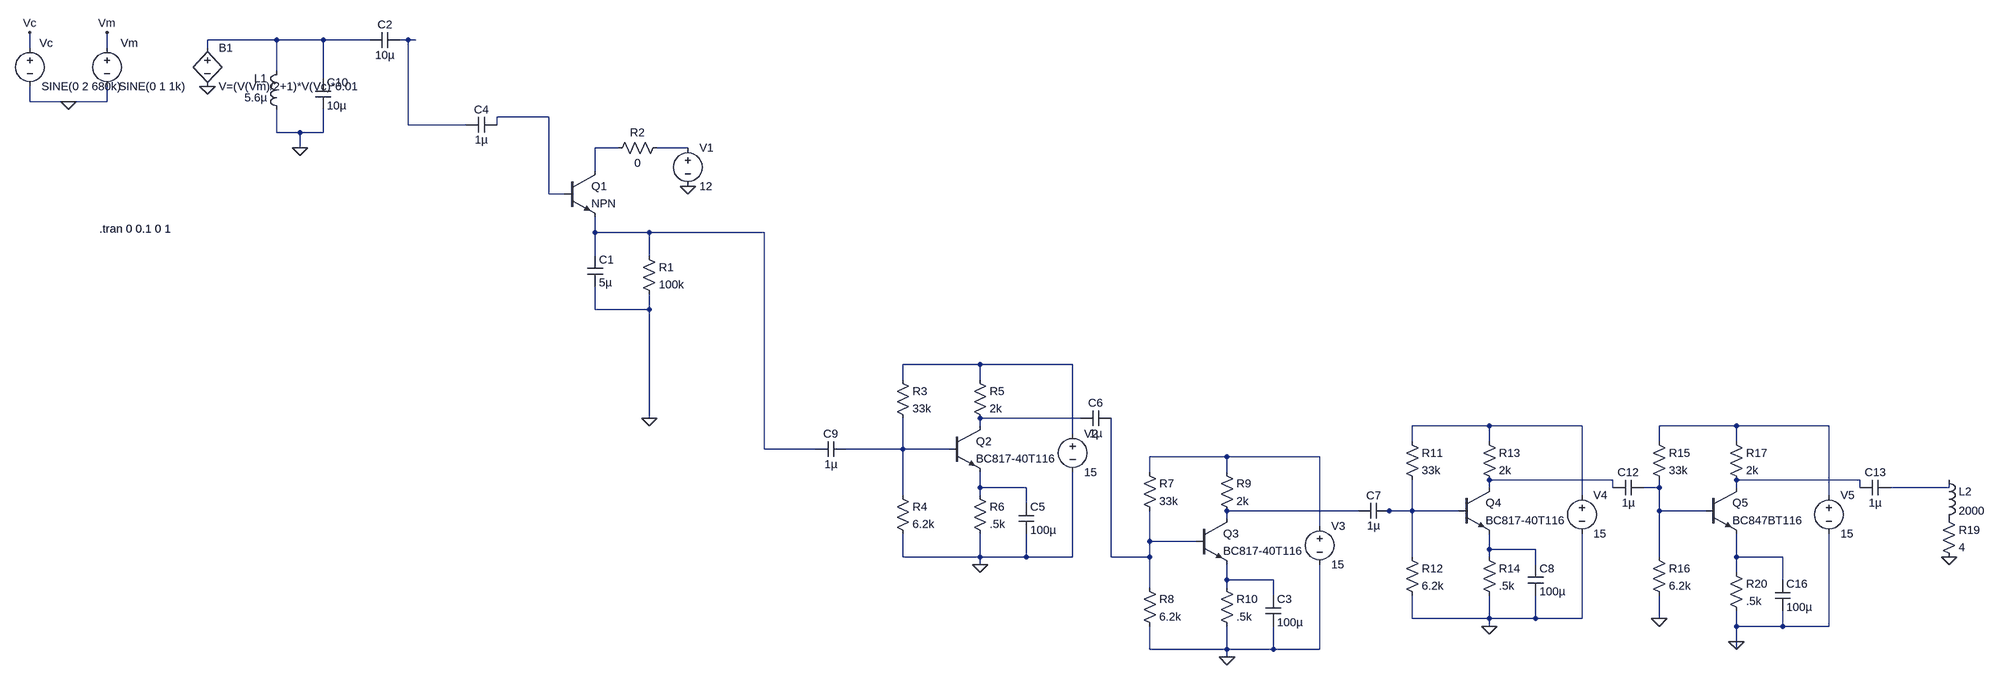
[diagram p0: schematic Final Draft3.asc]
Final Draft3.asc, the LTspice schematic file:
Version 4
SHEET 1 4400 1892
WIRE -352 160 -496 160
WIRE -256 160 -352 160
WIRE -160 160 -256 160
WIRE -80 160 -96 160
WIRE -64 160 -80 160
WIRE -864 176 -864 144
WIRE -704 176 -704 144
WIRE -496 176 -496 160
WIRE -352 224 -352 160
WIRE -256 240 -256 160
WIRE -864 288 -864 256
WIRE -784 288 -864 288
WIRE -704 288 -704 256
WIRE -704 288 -784 288
WIRE 512 320 336 320
WIRE -80 336 -80 160
WIRE 272 336 -80 336
WIRE 336 336 336 320
WIRE -352 352 -352 304
WIRE -304 352 -352 352
WIRE -256 352 -256 304
WIRE -256 352 -304 352
WIRE -304 384 -304 352
WIRE 656 384 608 384
WIRE 800 384 736 384
WIRE 608 432 608 384
WIRE 512 480 512 320
WIRE 544 480 512 480
WIRE 608 560 608 528
WIRE 720 560 608 560
WIRE 1072 560 720 560
WIRE 608 608 608 560
WIRE 720 608 720 560
WIRE 608 720 608 672
WIRE 720 720 720 688
WIRE 720 720 608 720
WIRE 1616 912 1456 912
WIRE 1808 912 1616 912
WIRE 1456 944 1456 912
WIRE 1616 944 1616 912
WIRE 720 1024 720 720
WIRE 1824 1024 1616 1024
WIRE 1616 1040 1616 1024
WIRE 2672 1040 2512 1040
WIRE 2864 1040 2672 1040
WIRE 3184 1040 3024 1040
WIRE 3376 1040 3184 1040
WIRE 1808 1056 1808 912
WIRE 2512 1072 2512 1040
WIRE 2672 1072 2672 1040
WIRE 3024 1072 3024 1040
WIRE 3184 1072 3184 1040
WIRE 1072 1088 1072 560
WIRE 1248 1088 1072 1088
WIRE 1456 1088 1456 1024
WIRE 1456 1088 1312 1088
WIRE 1552 1088 1456 1088
WIRE 2128 1104 1968 1104
WIRE 2320 1104 2128 1104
WIRE 1968 1136 1968 1104
WIRE 2128 1136 2128 1104
WIRE 2928 1152 2672 1152
WIRE 3440 1152 3184 1152
WIRE 1616 1168 1616 1136
WIRE 1712 1168 1616 1168
WIRE 2672 1168 2672 1152
WIRE 2928 1168 2928 1152
WIRE 3024 1168 3024 1152
WIRE 3024 1168 2992 1168
WIRE 3184 1168 3184 1152
WIRE 3440 1168 3440 1152
WIRE 3840 1168 3840 1152
WIRE 3840 1168 3504 1168
WIRE 1456 1184 1456 1088
WIRE 1616 1184 1616 1168
WIRE 2864 1184 2864 1040
WIRE 3376 1184 3376 1040
WIRE 1712 1200 1712 1168
WIRE 2400 1216 2128 1216
WIRE 2464 1216 2448 1216
WIRE 2512 1216 2512 1152
WIRE 2512 1216 2464 1216
WIRE 2608 1216 2512 1216
WIRE 3024 1216 3024 1168
WIRE 3120 1216 3024 1216
WIRE 2128 1232 2128 1216
WIRE 2320 1248 2320 1104
WIRE 1968 1280 1968 1216
WIRE 2064 1280 1968 1280
WIRE 2672 1296 2672 1264
WIRE 2768 1296 2672 1296
WIRE 1456 1312 1456 1264
WIRE 1616 1312 1616 1264
WIRE 1616 1312 1456 1312
WIRE 1712 1312 1712 1264
WIRE 1712 1312 1616 1312
WIRE 1808 1312 1808 1136
WIRE 1808 1312 1712 1312
WIRE 1888 1312 1888 1024
WIRE 1968 1312 1968 1280
WIRE 1968 1312 1888 1312
WIRE 2512 1312 2512 1216
WIRE 2672 1312 2672 1296
WIRE 3024 1312 3024 1216
WIRE 3184 1312 3184 1264
WIRE 3280 1312 3184 1312
WIRE 1616 1328 1616 1312
WIRE 2768 1328 2768 1296
WIRE 3184 1344 3184 1312
WIRE 2128 1360 2128 1328
WIRE 2224 1360 2128 1360
WIRE 3280 1360 3280 1312
WIRE 1968 1376 1968 1312
WIRE 2128 1376 2128 1360
WIRE 2224 1392 2224 1360
WIRE 2512 1440 2512 1392
WIRE 2672 1440 2672 1392
WIRE 2672 1440 2512 1440
WIRE 2768 1440 2768 1392
WIRE 2768 1440 2672 1440
WIRE 2864 1440 2864 1264
WIRE 2864 1440 2768 1440
WIRE 3024 1440 3024 1392
WIRE 2672 1456 2672 1440
WIRE 3184 1456 3184 1424
WIRE 3280 1456 3280 1424
WIRE 3280 1456 3184 1456
WIRE 3376 1456 3376 1264
WIRE 3376 1456 3280 1456
WIRE 3184 1488 3184 1456
WIRE 1968 1504 1968 1456
WIRE 2128 1504 2128 1456
WIRE 2128 1504 1968 1504
WIRE 2224 1504 2224 1456
WIRE 2224 1504 2128 1504
WIRE 2320 1504 2320 1328
WIRE 2320 1504 2224 1504
WIRE 3184 1504 3184 1488
WIRE 2128 1520 2128 1504
FLAG -496 256 0
FLAG -784 288 0
FLAG -704 144 Vm
FLAG -864 144 Vc
FLAG 800 464 0
FLAG 2128 1520 0
FLAG 2672 1456 0
FLAG -304 384 0
FLAG 1616 1328 0
FLAG 720 1024 0
FLAG 3184 1488 0
FLAG 3024 1440 0
FLAG 3840 1312 0
SYMBOL cap 592 608 R0
SYMATTR InstName C1
SYMATTR Value 5µ
SYMBOL res 704 592 R0
SYMATTR InstName R1
SYMATTR Value 100k
SYMBOL bv -496 160 R0
SYMATTR InstName B1
SYMATTR Value V=(V(Vm)/2+1)*V(Vc)*0.01
SYMBOL voltage -864 160 R0
WINDOW 123 0 0 Left 2
WINDOW 39 0 0 Left 2
WINDOW 0 20 6 Left 2
SYMATTR InstName Vc
SYMATTR Value SINE(0 2 680k)
SYMBOL voltage -704 160 R0
WINDOW 123 0 0 Left 2
WINDOW 39 0 0 Left 2
WINDOW 0 28 6 Left 2
SYMATTR InstName Vm
SYMATTR Value SINE(0 1 1k)
SYMBOL voltage 800 368 R0
WINDOW 123 0 0 Left 2
WINDOW 39 0 0 Left 2
SYMATTR InstName V1
SYMATTR Value 12
SYMBOL res 752 368 R90
WINDOW 0 0 56 VBottom 2
WINDOW 3 32 56 VTop 2
SYMATTR InstName R2
SYMATTR Value 0
SYMBOL cap -96 144 R90
WINDOW 0 0 32 VBottom 2
WINDOW 3 32 32 VTop 2
SYMATTR InstName C2
SYMATTR Value 10µ
SYMBOL res 1440 928 R0
SYMATTR InstName R3
SYMATTR Value 33k
SYMBOL res 1440 1168 R0
SYMATTR InstName R4
SYMATTR Value 6.2k
SYMBOL voltage 1808 1040 R0
WINDOW 123 0 0 Left 2
WINDOW 39 0 0 Left 2
SYMATTR InstName V2
SYMATTR Value 15
SYMBOL res 1600 928 R0
SYMATTR InstName R5
SYMATTR Value 2k
SYMBOL res 1600 1168 R0
SYMATTR InstName R6
SYMATTR Value .5k
SYMBOL cap 1696 1200 R0
SYMATTR InstName C5
SYMATTR Value 100µ
SYMBOL cap 336 320 R90
WINDOW 0 0 32 VBottom 2
WINDOW 3 32 32 VTop 2
SYMATTR InstName C4
SYMATTR Value 1µ
SYMBOL npn 2064 1232 R0
SYMATTR InstName Q3
SYMATTR Value BC817-40T116
SYMBOL res 1952 1120 R0
SYMATTR InstName R7
SYMATTR Value 33k
SYMBOL res 1952 1360 R0
SYMATTR InstName R8
SYMATTR Value 6.2k
SYMBOL voltage 2320 1232 R0
WINDOW 123 0 0 Left 2
WINDOW 39 0 0 Left 2
SYMATTR InstName V3
SYMATTR Value 15
SYMBOL res 2112 1120 R0
SYMATTR InstName R9
SYMATTR Value 2k
SYMBOL res 2112 1360 R0
SYMATTR InstName R10
SYMATTR Value .5k
SYMBOL cap 2208 1392 R0
SYMATTR InstName C3
SYMATTR Value 100µ
SYMBOL cap 2464 1200 R90
WINDOW 0 0 32 VBottom 2
WINDOW 3 32 32 VTop 2
SYMATTR InstName C7
SYMATTR Value 1µ
SYMBOL npn 2608 1168 R0
SYMATTR InstName Q4
SYMATTR Value BC817-40T116
SYMBOL res 2496 1056 R0
SYMATTR InstName R11
SYMATTR Value 33k
SYMBOL res 2496 1296 R0
SYMATTR InstName R12
SYMATTR Value 6.2k
SYMBOL voltage 2864 1168 R0
WINDOW 123 0 0 Left 2
WINDOW 39 0 0 Left 2
SYMATTR InstName V4
SYMATTR Value 15
SYMBOL res 2656 1056 R0
SYMATTR InstName R13
SYMATTR Value 2k
SYMBOL res 2656 1296 R0
SYMATTR InstName R14
SYMATTR Value .5k
SYMBOL cap 2752 1328 R0
SYMATTR InstName C8
SYMATTR Value 100µ
SYMBOL ind -336 320 R180
WINDOW 0 36 80 Left 2
WINDOW 3 36 40 Left 2
SYMATTR InstName L1
SYMATTR Value 5.6µ
SYMBOL cap -272 240 R0
SYMATTR InstName C10
SYMATTR Value 10µ
SYMBOL cap 2992 1152 R90
WINDOW 0 0 32 VBottom 2
WINDOW 3 32 32 VTop 2
SYMATTR InstName C12
SYMATTR Value 1µ
SYMBOL npn 544 432 R0
SYMATTR InstName Q1
SYMBOL npn 1552 1040 R0
SYMATTR InstName Q2
SYMATTR Value BC817-40T116
SYMBOL cap 1888 1008 R90
WINDOW 0 0 32 VBottom 2
WINDOW 3 32 32 VTop 2
SYMATTR InstName C6
SYMATTR Value 1µ
SYMBOL cap 1312 1072 R90
WINDOW 0 0 32 VBottom 2
WINDOW 3 32 32 VTop 2
SYMATTR InstName C9
SYMATTR Value 1µ
SYMBOL npn 3120 1168 R0
SYMATTR InstName Q5
SYMATTR Value BC847BT116
SYMBOL res 3008 1056 R0
SYMATTR InstName R15
SYMATTR Value 33k
SYMBOL res 3008 1296 R0
SYMATTR InstName R16
SYMATTR Value 6.2k
SYMBOL voltage 3376 1168 R0
WINDOW 123 0 0 Left 2
WINDOW 39 0 0 Left 2
SYMATTR InstName V5
SYMATTR Value 15
SYMBOL res 3168 1056 R0
SYMATTR InstName R17
SYMATTR Value 2k
SYMBOL cap 3504 1152 R90
WINDOW 0 0 32 VBottom 2
WINDOW 3 32 32 VTop 2
SYMATTR InstName C13
SYMATTR Value 1µ
SYMBOL res 3168 1328 R0
SYMATTR InstName R20
SYMATTR Value .5k
SYMBOL cap 3264 1360 R0
SYMATTR InstName C16
SYMATTR Value 100µ
SYMBOL ind 3824 1136 R0
SYMATTR InstName L2
SYMATTR Value 2000
SYMBOL res 3824 1216 R0
SYMATTR InstName R19
SYMATTR Value 4
TEXT -720 552 Left 2 !.tran 0 0.1 0 1

The netlist it stands for:
* Final Draft3.asc
C1 N006 0 5µ
R1 N006 0 100k
B1 N001 0 V=(V(Vm)/2+1)*V(Vc)*0.01
Vc Vc 0 SINE(0 2 680k)
Vm Vm 0 SINE(0 1 1k)
V1 N005 0 12
R2 N005 N004 0
C2 N002 N001 10µ
R3 N007 N011 33k
R4 N011 0 6.2k
V2 N007 0 15
R5 N007 N008 2k
R6 N015 0 .5k
C5 N015 0 100µ
C4 N003 N002 1µ
Q3 N018 N020 N023 0 BC817-40T116
R7 N012 N020 33k
R8 N020 0 6.2k
V3 N012 0 15
R9 N012 N018 2k
R10 N023 0 .5k
C3 N023 0 100µ
C7 N019 N018 1µ
Q4 N013 N019 N021 0 BC817-40T116
R11 N009 N019 33k
R12 N019 0 6.2k
V4 N009 0 15
R13 N009 N013 2k
R14 N021 0 .5k
C8 N021 0 100µ
L1 0 N001 5.6µ
C10 N001 0 10µ
C12 N016 N013 1µ
Q1 N004 N003 N006 0 NPN
Q2 N008 N011 N015 0 BC817-40T116
C6 N020 N008 1µ
C9 N011 N006 1µ
Q5 N014 N016 N022 0 BC847BT116
R15 N010 N016 33k
R16 N016 0 6.2k
V5 N010 0 15
R17 N010 N014 2k
C13 N017 N014 1µ
R20 N022 0 .5k
C16 N022 0 100µ
L2 N017 P001 2000
R19 P001 0 4
.model NPN NPN
.model PNP PNP
.lib standard.bjt
.tran 0 0.1 0 1
.backanno
.end